# EAGLE design dual15v (EAGLE 9.6.2)
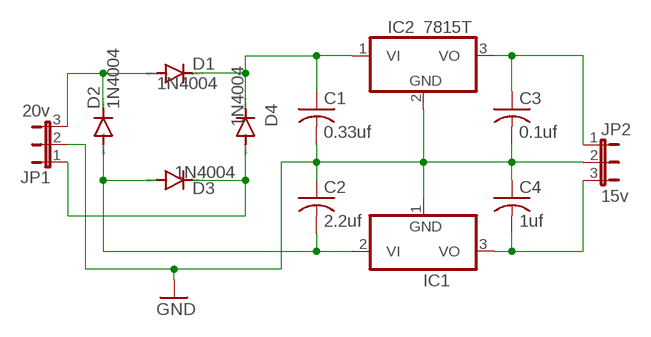
[diagram p0: schematic, sheet 1]

## Parts
C1  0.33uf  C-US025-025X050  [C025-025X050]
C2  2.2uf  C-US025-025X050  [C025-025X050]
C3  0.1uf  C-US025-025X050  [C025-025X050]
C4  1uf  C-US025-025X050  [C025-025X050]
D1  1N4004  [DO41-10]
D2  1N4004  [DO41-10]
D3  1N4004  [DO41-10]
D4  1N4004  [DO41-10]
IC1  7915T  [TO220H]
IC2  7815T  [TO220H]
JP1  20v  JP2E  [JP2]
JP2  15v  JP2E  [JP2]

## Nets
GND: C1.2 C2.1 C3.2 C4.1 IC1.1(GND) IC2.2(GND) JP1.2 JP2.2
N$1: D1.A D2.C JP1.3
N$2: C2.2 D2.A D3.A IC1.2(VI)
N$3: D3.C D4.A JP1.1
N$4: C1.1 D1.C D4.C IC2.1(VI)
N$6: C4.2 IC1.3(VO) JP2.3
N$8: C3.1 IC2.3(VO) JP2.1

## Library data of the parts
C1-C4 = rcl:C-US: CAPACITOR, American symbol; SPICEPREFIX: C
D1-D4 = diode:1N4004: DIODE general purpose rectifier, 1 A
IC1 = linear:79*: Negative VOLTAGE REGULATOR
IC2 = linear:78*: Positive VOLTAGE REGULATOR Source: http://cache.national.com/ds/LM/LM78L05.pdf http://www.fairchildsemi.com/ds/LM/LM7805.pdf
JP1 JP2 = jumper:JP2E: JUMPER

## Board
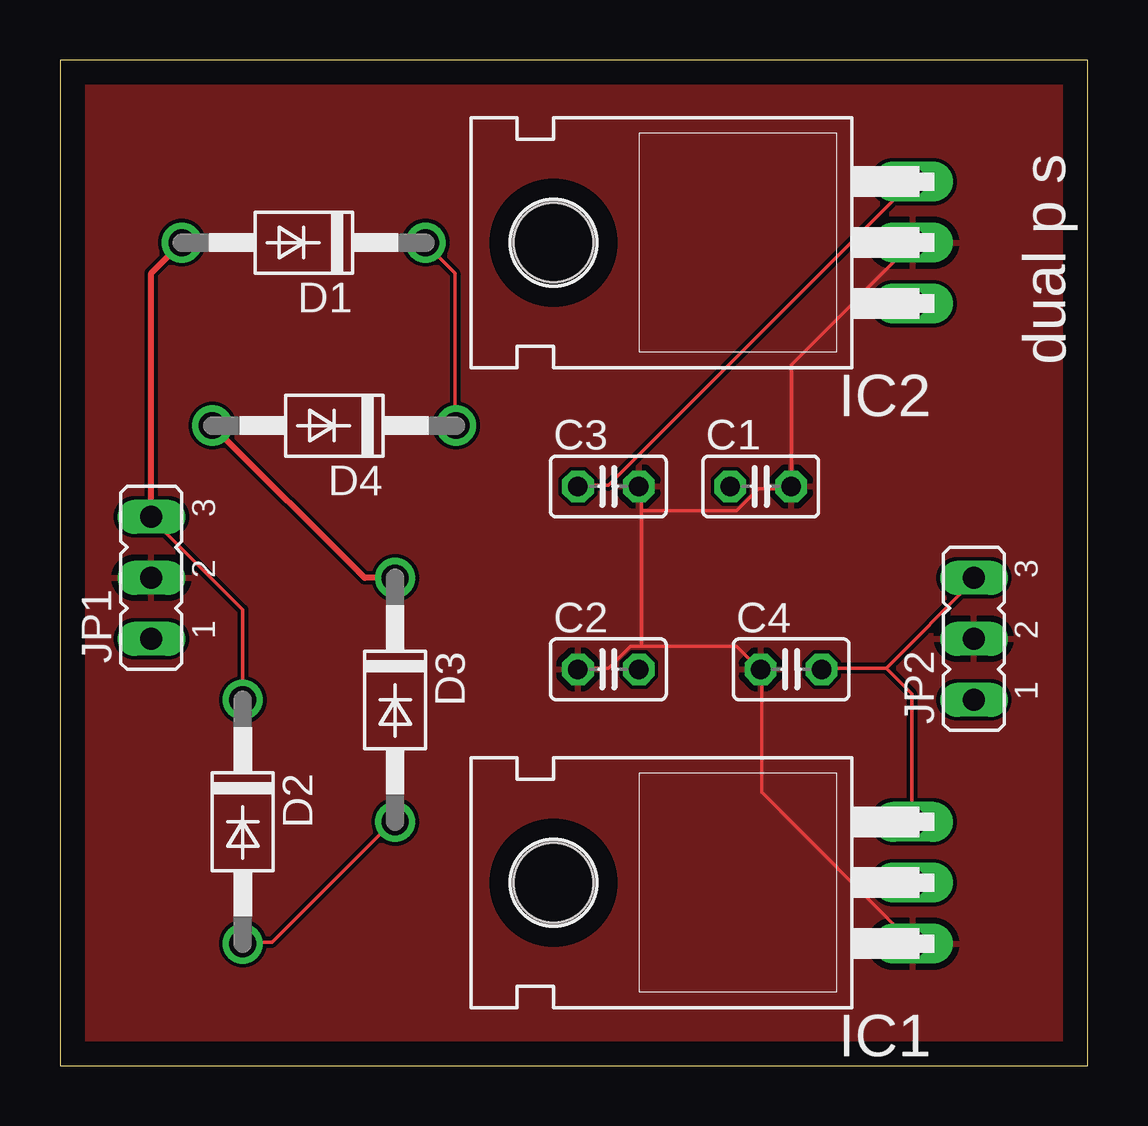
[diagram p1: board, top side]
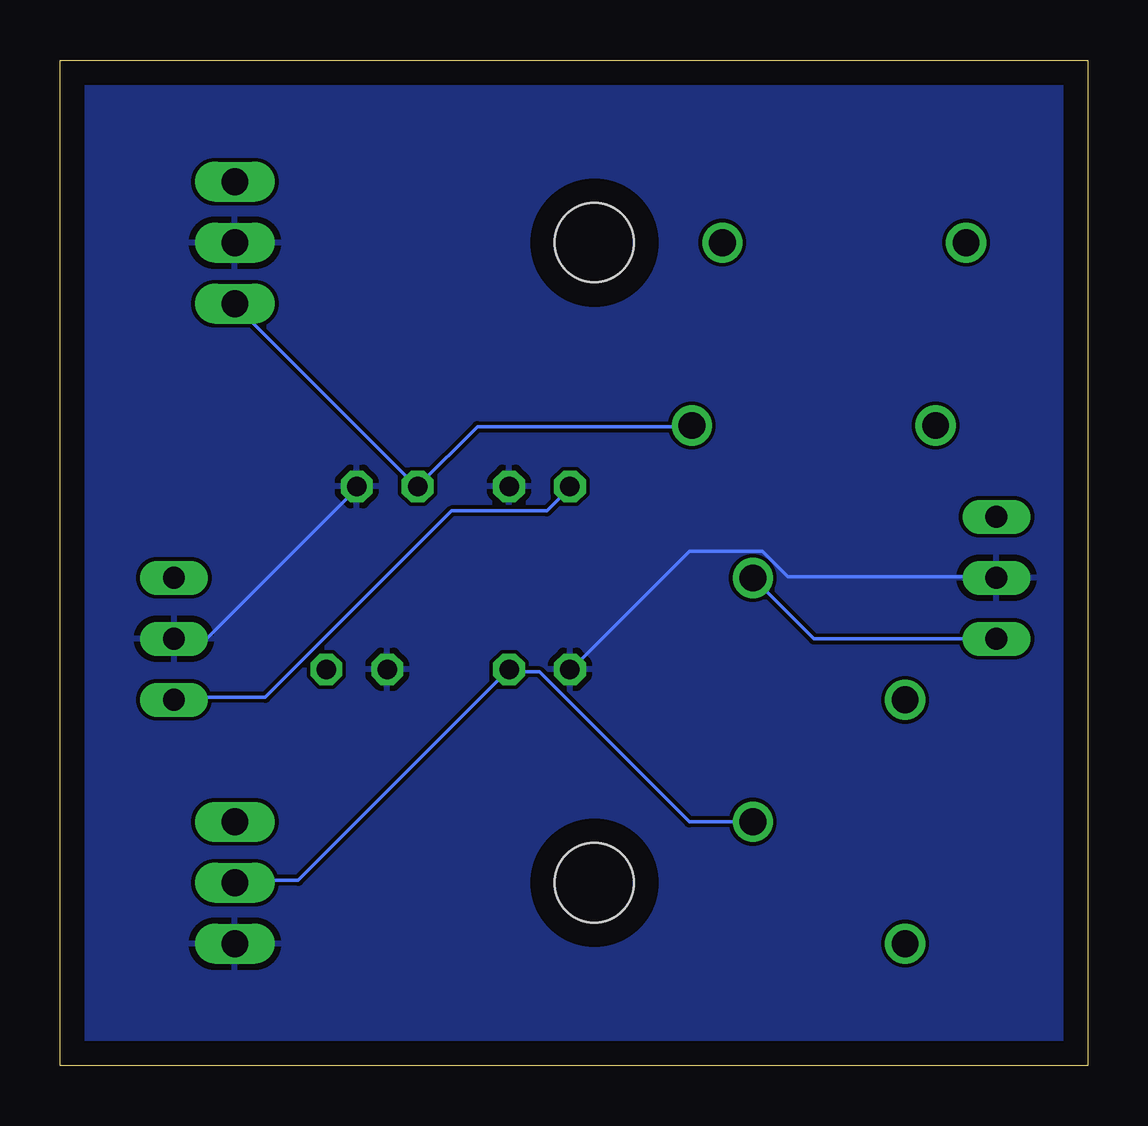
[diagram p2: board, bottom side, seen from below]

Size 42.85 x 41.9 mm. Coordinates in mm from the lower left corner, seen from the top.
Outline: 0,0 42.85,0 42.85,41.9 0,41.9 0,0
Copper layers (1*16): Top 0.035mm / dielectric 1.5mm / Bottom 0.035mm
Design rules "default": minimum track width 6mil, minimum drill 0.35mm, track to track 6mil, track to pad 6mil, pad to pad 6mil, via to via 6mil, smd to smd 6mil, copper to edge 40mil, drill to drill 6mil, minimum pad ring 10mil, minimum via ring 8mil, stop-mask expansion 4mil, vias tented up to drill 0mil, thermal gap 10mil

### Footprints (pad centres in the part's own frame; a part is rotated, then mirrored left to right if it is on the bottom)
C025-025X050 = drill 0.813 octagon: 1 -1.27,0; 2 1.27,0
DO41-10 = drill 1.118: A 5.08,0; C -5.08,0
TO220H = drill 1.118 long: 1 -2.54,-10.16; 2 0,-10.16; 3 2.54,-10.16 | hole 3.302: 0,4.826
JP2 = drill 0.914 long: 1 -2.54,0; 2 0,0; 3 2.54,0

### Placement (x,y rotation side)
C1  29.21,24.13 0 top
C2  22.86,16.51 0 top
C3  22.86,24.13 0 top
C4  30.48,16.51 0 top
D1  10.16,34.29 180 top
D2  7.62,10.16 270 top
D3  13.97,15.24 270 top
D4  11.43,26.67 180 top
IC1  25.4,7.62 90 top
IC2  25.4,34.29 90 top
JP1  3.81,20.32 90 top
JP2  38.1,17.78 90 top

### Tracks (layer width: path | path; a pad name or v marks a point on that pad's centre or on a via)
GND
  Top 0.152: 24.23,17.48 28.19,17.48 29.11,16.56 C4.1 29.26,16.41 29.26,11.38 IC1.1 | 24.23,17.48 23.77,17.48 22.86,16.56 21.64,16.56 C2.1 | 24.23,17.48 24.23,23.11 | 24.23,23.11 24.23,24.03 C3.2 | 24.23,23.11 28.19,23.11 29.11,24.03 30.48,24.03 C1.2 30.48,29.21 IC2.2
  Bottom 0.152: JP1.2 3.81,20.37 12.5,20.37 13.56,21.44 16.61,21.44 21.49,16.56 C2.1 | JP2.2 36.73,17.78 30.48,24.03 C1.2
  pour Top: -1.27,43.18 44.45,43.18 44.45,-1.27 -1.27,-1.27
  pour Bottom: -2.54,44.45 45.72,44.45 45.72,-2.54 -2.54,-2.54
N$1
  Top 0.152: D2.C 7.62,19 3.81,22.81 JP1.3
  Top 0.254: JP1.3 3.81,33.02 D1.A
N$2
  Top 0.152: D2.A 7.62,5.13 8.84,5.13 13.87,10.16 D3.A
  Bottom 0.152: D3.A 16.61,10.16 22.86,16.41 24.08,16.41 C2.2 32.92,7.72 35.51,7.72 IC1.2
N$3
  Top 0.254: D3.C 12.7,20.32 D4.A
  Bottom 0.152: JP1.1 11.43,17.78 D3.C
N$4
  Top 0.152: D4.C 16.46,26.77 16.46,33.02 15.24,34.24 D1.C
  Bottom 0.152: IC2.1 35.51,31.65 28.04,24.18 C1.1 25.45,26.62 16.61,26.62 D4.C
N$6
  Top 0.152: 34.44,16.56 31.85,16.56 C4.2 | 34.44,16.56 38.1,20.22 JP2.3 | 34.44,16.56 35.51,15.49 35.51,10.16 IC1.3
N$8
  Top 0.152: C3.1 21.64,24.18 22.86,24.18 35.51,36.83 IC2.3
  Bottom 0.152: JP2.1 38.1,15.34 34.29,15.34 26.52,23.11 22.55,23.11 21.64,24.03 C3.1

### Text on the board
tNames: dual p s